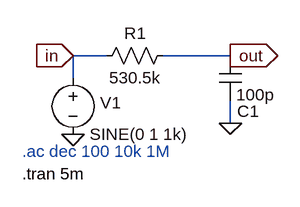
[diagram p0: schematic LPF.asc]
LPF.asc, the LTspice schematic file:
Version 4.1
SHEET 1 880 680
WIRE 32 128 -16 128
WIRE 208 128 112 128
WIRE -16 160 -16 128
WIRE 208 224 208 192
FLAG -16 128 in
IOPIN -16 128 In
FLAG 208 128 out
IOPIN 208 128 Out
FLAG 208 224 0
FLAG -16 240 0
SYMBOL res 128 112 R90
WINDOW 0 0 56 VBottom 2
WINDOW 3 32 56 VTop 2
SYMATTR InstName R1
SYMATTR Value 530.5k
SYMBOL cap 192 128 R0
WINDOW 0 26 79 Left 2
SYMATTR InstName C1
SYMATTR Value 100p
SYMBOL voltage -16 144 R0
WINDOW 0 39 51 Left 2
SYMATTR InstName V1
SYMATTR Value SINE(0 1 1k)
TEXT -88 264 Left 2 ;.ac dec 100 10k 1M
TEXT -88 296 Left 2 !.tran 5m

The netlist it stands for:
* LPF.asc
R1 out in 530.5k
C1 out 0 100p
V1 in 0 SINE(0 1 1k)
* .ac dec 100 10k 1M
.tran 5m
.backanno
.end